# Altium schematic sheet VFD_alpha_Sheet0.SchDoc
size A4
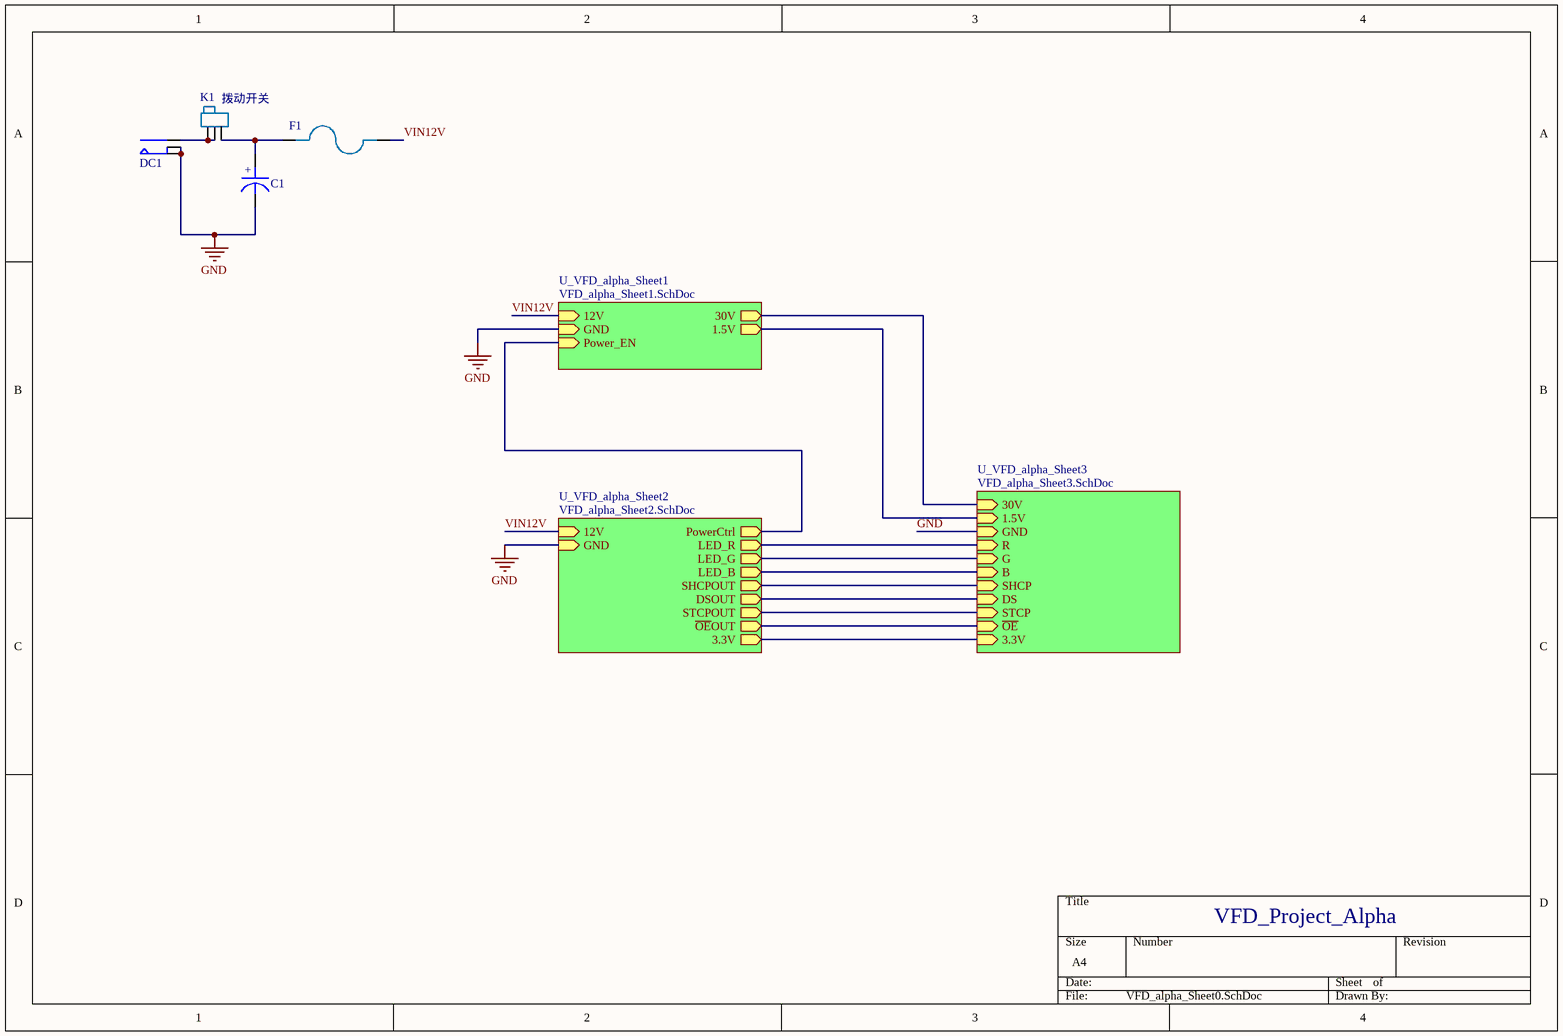
[diagram p0: VFD_alpha_Sheet0.SchDoc]

## Parts
C1  CAP_D5  [CAP_5_2]  (value not drawn)
DC1  DC-5.5  [DC5.5]  (value not drawn)
F1  保险丝  [1812]  (value not drawn)
K1  拨动开关  [拨动开关]

## Sub-sheets
U_VFD_alpha_Sheet1 = VFD_alpha_Sheet1.SchDoc: 12V (in), GND (in), 30V (out), 1.5V (out), Power_EN (in)
U_VFD_alpha_Sheet2 = VFD_alpha_Sheet2.SchDoc: 12V (in), GND (in), PowerCtrl (out), LED_R (out), LED_G (out), LED_B (out), SHCPOUT (out), DSOUT (out), STCPOUT (out), ~{OE}OUT (out), 3.3V (out)
U_VFD_alpha_Sheet3 = VFD_alpha_Sheet3.SchDoc: 30V (in), 1.5V (in), GND (in), R (in), G (in), B (in), SHCP (in), DS (in), STCP (in), ~{OE} (in), 3.3V (in)

## Nets
GND: C1.2 DC1.2 DC1.3 ; sheet U_VFD_alpha_Sheet1/GND, sheet U_VFD_alpha_Sheet2/GND, sheet U_VFD_alpha_Sheet3/GND
VIN12V: F1.2 ; sheet U_VFD_alpha_Sheet1/12V, sheet U_VFD_alpha_Sheet2/12V
NetC1_1: C1.1 F1.1 K1.3
NetDC1_1: DC1.1 K1.1 K1.2
(unnamed): sheet U_VFD_alpha_Sheet1/30V, sheet U_VFD_alpha_Sheet3/30V
(unnamed): sheet U_VFD_alpha_Sheet1/1.5V, sheet U_VFD_alpha_Sheet3/1.5V
(unnamed): sheet U_VFD_alpha_Sheet1/Power_EN, sheet U_VFD_alpha_Sheet2/PowerCtrl
(unnamed): sheet U_VFD_alpha_Sheet2/LED_R, sheet U_VFD_alpha_Sheet3/R
(unnamed): sheet U_VFD_alpha_Sheet2/LED_G, sheet U_VFD_alpha_Sheet3/G
(unnamed): sheet U_VFD_alpha_Sheet2/LED_B, sheet U_VFD_alpha_Sheet3/B
(unnamed): sheet U_VFD_alpha_Sheet2/SHCPOUT, sheet U_VFD_alpha_Sheet3/SHCP
(unnamed): sheet U_VFD_alpha_Sheet2/DSOUT, sheet U_VFD_alpha_Sheet3/DS
(unnamed): sheet U_VFD_alpha_Sheet2/STCPOUT, sheet U_VFD_alpha_Sheet3/STCP
(unnamed): sheet U_VFD_alpha_Sheet2/~{OE}OUT, sheet U_VFD_alpha_Sheet3/~{OE}
(unnamed): sheet U_VFD_alpha_Sheet2/3.3V, sheet U_VFD_alpha_Sheet3/3.3V

## Notes on the sheet
- VFD_Project_Alpha
- (in symbol CAP_D5) +